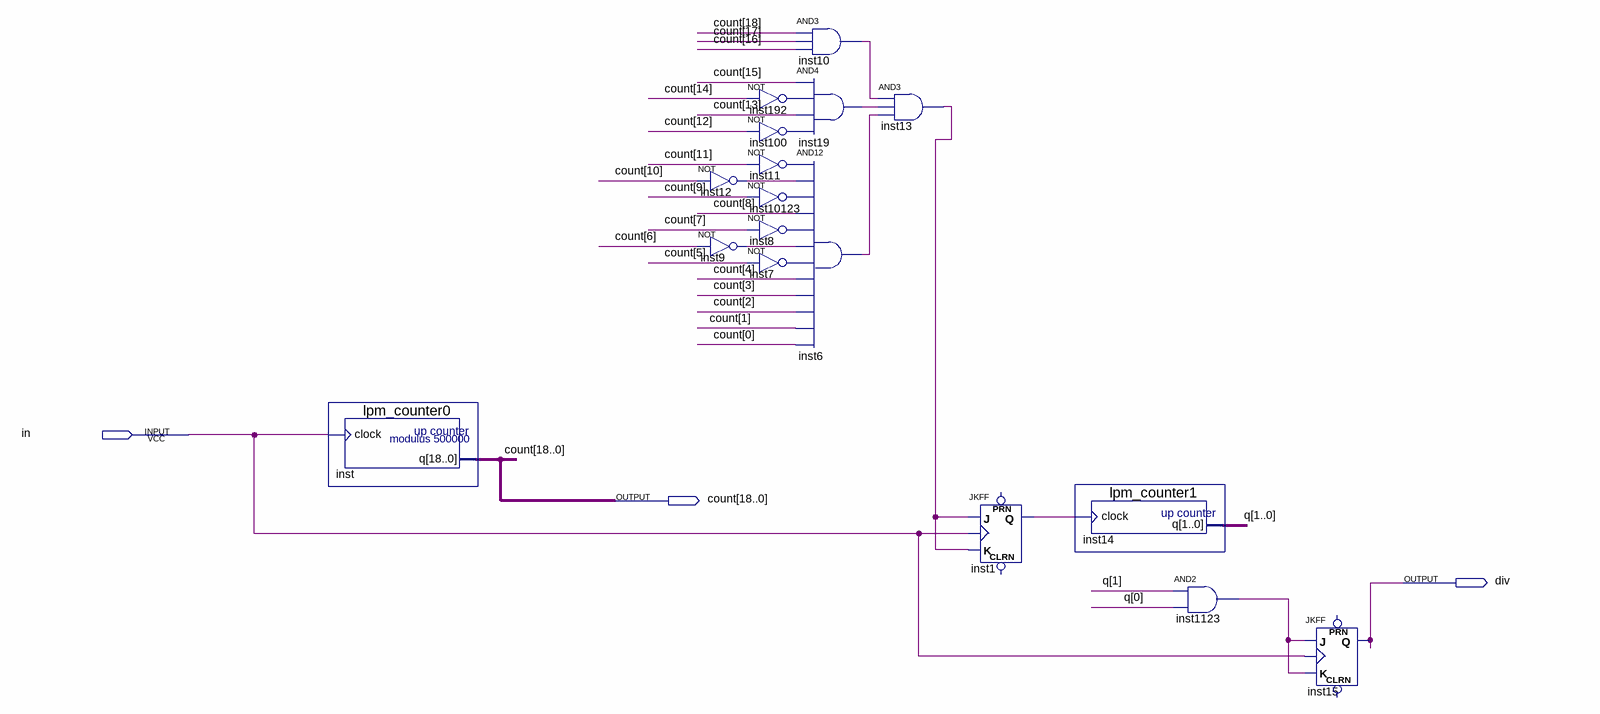
[diagram p0: schematic sheet]
// Quartus schematic stopwatch.bdf as structural Verilog: 17 symbols, 3 pins
module stopwatch (
  input  in,
  output [18:0] count,
  output div
);

  wire inst1_q, inst6_out, inst7_out, inst8_out, inst9_out, inst10_out, inst11_out, inst12_out, inst13_out,
       inst19_out, inst100_out, inst192_out, inst1123_out, inst10123_out;
  wire [1:0] q;

  lpm_counter0 inst (.clock(in), .q(count));
  not inst12 (inst12_out, count[10]);
  not inst9 (inst9_out, count[6]);
  and inst10 (inst10_out, count[18], count[17], count[16]);
  and inst19 (inst19_out, count[15], inst192_out, count[13], inst100_out);
  not inst192 (inst192_out, count[14]);
  not inst100 (inst100_out, count[12]);
  and inst6 (inst6_out, inst11_out, inst12_out, inst10123_out, count[8], inst8_out, inst9_out, inst7_out, count[4], count[3], count[2], count[1], count[0]);
  not inst11 (inst11_out, count[11]);
  not inst10123 (inst10123_out, count[9]);
  not inst8 (inst8_out, count[7]);
  not inst7 (inst7_out, count[5]);
  and inst13 (inst13_out, inst10_out, inst19_out, inst6_out);
  JKFF inst1 (.K(inst13_out), .J(inst13_out), .CLK(in), .Q(inst1_q));  // open: PRN, CLRN
  lpm_counter1 inst14 (.clock(inst1_q), .q(q));
  and inst1123 (inst1123_out, q[1], q[0]);
  JKFF inst15 (.K(inst1123_out), .J(inst1123_out), .CLK(in), .Q(div));  // open: PRN, CLRN
endmodule
